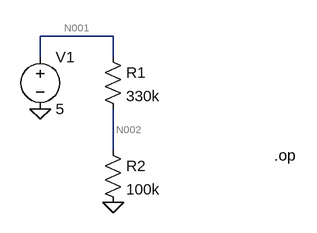
[diagram p0: schematic Draft3.asc]
Draft3.asc, the LTspice schematic file:
Version 4
SHEET 1 880 680
WIRE 160 48 48 48
WIRE 48 80 48 48
WIRE 160 80 160 48
WIRE 160 224 160 160
FLAG 160 304 0
FLAG 48 160 0
SYMBOL res 144 64 R0
SYMATTR InstName R1
SYMATTR Value 330k
SYMBOL res 144 208 R0
SYMATTR InstName R2
SYMATTR Value 100k
SYMBOL voltage 48 64 R0
WINDOW 123 0 0 Left 0
WINDOW 39 0 0 Left 0
SYMATTR InstName V1
SYMATTR Value 5
TEXT 408 232 Left 2 !.op

The netlist it stands for:
* Draft3.asc
R1 N001 N002 330k
R2 N002 0 100k
V1 N001 0 5
.op
.backanno
.end

* Results of the author's LTspice run, read from the files saved beside the schematic
* Operating Point:
*   V(n001) = 5 V
*   V(n002) = 1.163 V
*   I(R2) = 11.63 µA
*   I(R1) = 11.63 µA
*   I(V1) = -11.63 µA